# Altium schematic sheet 02_MCU_Control_UI.SchDoc
size A4; SheetNumber: 2; SheetTotal: 6
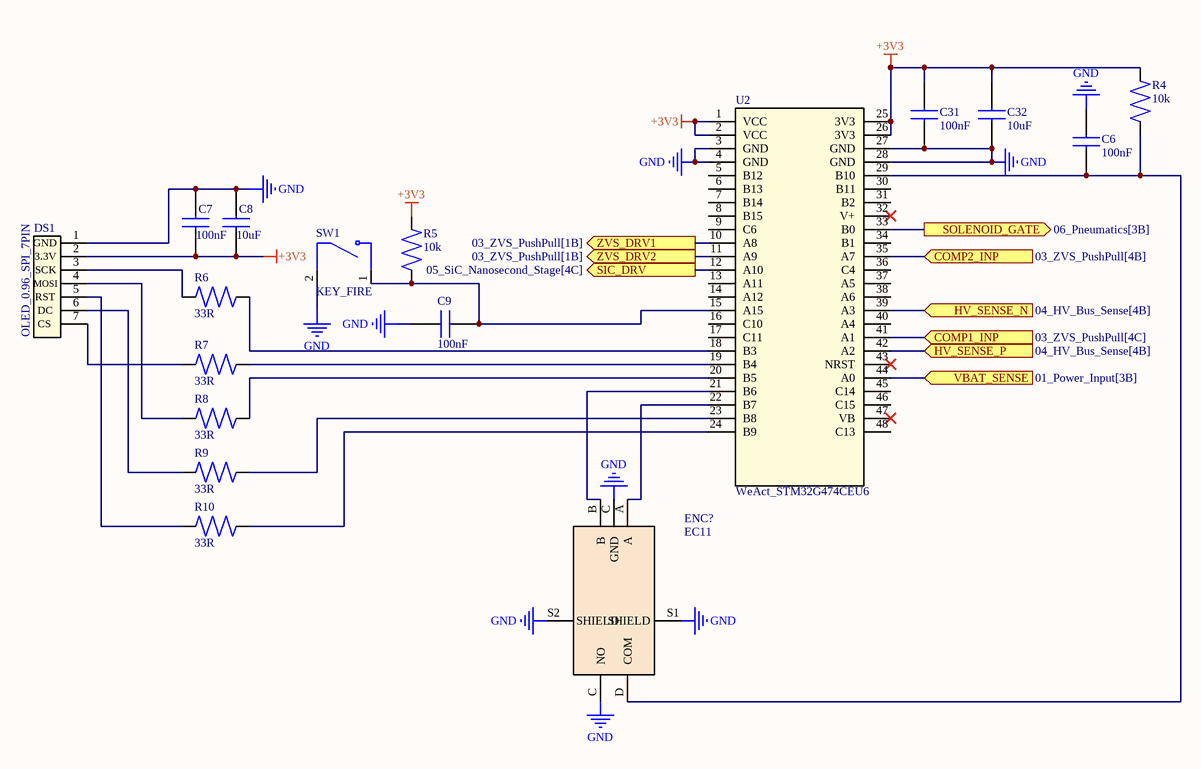
[diagram p0: 02_MCU_Control_UI.SchDoc]

## Parts
C6  100nF  [CHIP_0603_SMD]
C7  100nF  [CHIP_0603_SMD]
C8  10uF  [CHIP_0805_SMD]
C9  100nF  [CHIP_0603_SMD]
C31  100nF  [CHIP_0603_SMD]
C32  10uF  [CHIP_0805_SMD]
DS1  OLED_0.96_SPI_7PIN  [DISP_OLED_0.96_SSD1306_SPI_7PIN_THT]
ENC?  EC11  [ENC_EC11_VERTICAL_THT]
R4  10k  [CHIP_0603_SMD]
R5  10k  [CHIP_0603_SMD]
R6  33R  [CHIP_0603_SMD]
R7  33R  [CHIP_0603_SMD]
R8  33R  [CHIP_0603_SMD]
R9  33R  [CHIP_0603_SMD]
R10  33R  [CHIP_0603_SMD]
SW1  KEY_FIRE  [PAD_WIRE_2P_STRAIN_P2.54]
U2  WeAct_STM32G474CEU6  [MODULE_WEACT_STM32G474CEU6_DIP]

## Ports
COMP1_INP (in, see 03_ZVS_PushPull[4C]), COMP2_INP (in, see 03_ZVS_PushPull[4B]), HV_SENSE_N (in, see 04_HV_Bus_Sense[4B]), HV_SENSE_P (in, see 04_HV_Bus_Sense[4B]), SIC_DRV (out, see 05_SiC_Nanosecond_Stage[4C]), SOLENOID_GATE (out, see 06_Pneumatics[3B]), VBAT_SENSE (in, see 01_Power_Input[3B]), ZVS_DRV1 (out, see 03_ZVS_PushPull[1B]), ZVS_DRV2 (out, see 03_ZVS_PushPull[1B])

## Nets
+3V3: C7.1 C8.1 C31.2 C32.2 DS1.2(3.3V) R4.2 R5.2 U2.1(VCC) U2.2(VCC) U2.25(3V3) U2.26(3V3)
GND: C6.1 C7.2 C8.2 C9.1 C31.1 C32.1 DS1.1(GND) ENC?.C(GND) ENC?.S1(SHIELD) ENC?.S2(SHIELD) ENC?.С(NO) SW1.2 U2.3(GND) U2.4(GND) U2.27(GND) U2.28(GND)
COMP1_INP: U2.41(A1) ; port COMP1_INP
COMP2_INP: U2.35(A7) ; port COMP2_INP
HV_SENSE_N: U2.39(A3) ; port HV_SENSE_N
HV_SENSE_P: U2.42(A2) ; port HV_SENSE_P
SIC_DRV: U2.12(A10) ; port SIC_DRV
SOLENOID_GATE: U2.33(B0) ; port SOLENOID_GATE
VBAT_SENSE: U2.44(A0) ; port VBAT_SENSE
ZVS_DRV1: U2.10(A8) ; port ZVS_DRV1
ZVS_DRV2: U2.11(A9) ; port ZVS_DRV2
NetC6_2: C6.2 ENC?.D(COM) R4.1 U2.29(B10)
NetC9_2: C9.2 R5.1 SW1.1 U2.15(A15)
NetDS1_3: DS1.3(SCK) R6.1
NetDS1_4: DS1.4(MOSI) R8.1
NetDS1_5: DS1.5(RST) R10.2
NetDS1_6: DS1.6(DC) R9.1
NetDS1_7: DS1.7(CS) R7.1
NetENC?_A: ENC?.A U2.22(B7)
NetENC?_B: ENC?.B U2.21(B6)
NetR6_2: R6.2 U2.18(B3)
NetR7_2: R7.2 U2.19(B4)
NetR8_2: R8.2 U2.20(B5)
NetR9_2: R9.2 U2.23(B8)
NetR10_1: R10.1 U2.24(B9)

Not connected (* = marked no-connect by the designer): U2 5(B12_) 6(B13_) 7(B14_) 8(B15_) 9(C6) 13(A11) 14(A12) 16(C10) 17(C11) 30(B11) 31(B2) 32(V+)* 34(B1) 36(C4) 37(A5) 38(A6) 40(A4) 43(NRST)* 45(C14) 46(C15) 47(VB)* 48(C13)

## Library data of the parts
C6 C7 C9 C31 = CAP_0603_100nF_50V_X7R: Capacitor MLCC, Ceramic, 100 nF, 50 V, ±10%, X7R, SMD 0603, Samsung Electro-Mechanics; Part Number:: CL10B104KB8NNNC
C8 C32 = CAP_0805_10uF_16V_X7R: Capacitor MLCC, Ceramic, 10 uF, 16 V, ±10%, X7R, SMD 0805, Hitano Enterprise; Part Number:: 0805B106K160NT
DS1 = OLED_0.96_SPI_7PIN: Fast monochrome screen (with a resolution of 128x64 pixels that is connected via a  seven-wire bus
ENC? = ENC_EC11_THT_SW: Rotary Encoder Incremental, 2-Bit Quadrature, with Push-Button Switch, 20 PPR, Through-Hole (THT), D-Shaft 20mm, Alps Alpine / Generic
R4 R5 = RES_0603_10k_1%: Resistor, 10 kOhm, ±1%, 0.1W (1/10W), 75V, SMD 0603, Thick Film, Hitano
R6-R10 = RES_0603_33R_1%: Resistor, 33 Ohm, ±1%, 0.1W (1/10W), SMD 0603, Thick Film, Yageo; Part Number:: RC0603FR-0733RL; Manufacturer:: Yageo
SW1 = SW_PUSH_OFF-ON_PANEL: Switch Tactile
U2 = WeAct_STM32G474CEU6: Arm Cortex-M4 core with DSP and FPU, 170MHz with 32Kbytes of Flash memory, Math Accelerator, Medium Analog level integration STM board